# Altium schematic sheet POWER SWITCH AND LDO.SchDoc
size 420 x 297 mm; SheetNumber: 3; SheetTotal: 6
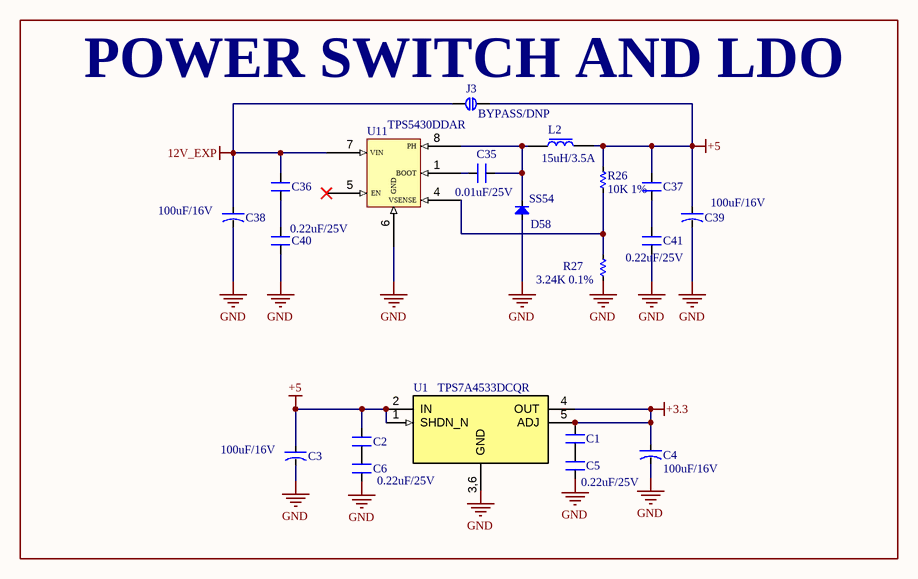
[diagram p0: POWER SWITCH AND LDO.SchDoc]

## Parts
C1  0.22uF/25V  [SM-0603]  (value not drawn)
C2  0.22uF/25V  [SM-0603]
C3  100uF/16V  [CAP TANT 2312]
C4  100uF/16V  [CAP TANT 2312]
C5  0.22uF/25V  [SM-0603]
C6  0.22uF/25V  [SM-0603]  (value not drawn)
C35  0.01uF/25V  [SM-0603]
C36  0.22uF/25V  [SM-0603]  (value not drawn)
C37  0.22uF/25V  [SM-0603]  (value not drawn)
C38  100uF/16V  [CAP TANT 2312]
C39  100uF/16V  [CAP TANT 2312]
C40  0.22uF/25V  [SM-0603]
C41  0.22uF/25V  [SM-0603]
D58  SS54  [DIO-SMD-A]
J3  BYPASS/DNP  [BIG_CONNECTOR]
L2  15uH/3.5A  [SRP7050TA]
R26  10K 1%  [RES-SMD-0603]
R27  3.24K 0.1%  [RES-SMD-0603]
U1  TPS7A4533DCQR  [SOT223-6]
U11  TPS5430DDAR  [HSOP8]

## Blocks framed on the sheet
POWER SWITCH AND LDO: C1-C6 C35-C41 D58 J3 L2 R26 R27 U1 U11

## Nets
12V_EXP: C36.2 C38.1 J3.1 U11.7(VIN)
+3.3: C1.2 C4.1 U1.4(OUT) U1.5(ADJ)
+5: C2.2 C3.1 C37.2 C39.1 J3.2 L2.2 R26.2 U1.1(SHDN_N) U1.2(IN)
GND: C3.2 C4.2 C5.1 C6.1 C38.2 C39.2 C40.1 C41.1 D58.1(A) R27.1 U1.3,6(GND) U11.6(GND)
NetC1_1: C1.1 C5.2
NetC2_1: C2.1 C6.2
NetC35_1: C35.1 D58.2(K) L2.1 U11.8(PH)
NetC35_2: C35.2 U11.1(BOOT)
NetC36_1: C36.1 C40.2
NetC37_1: C37.1 C41.2
NetR26_1: R26.1 R27.2 U11.4(VSENSE)

Not connected (* = marked no-connect by the designer): U11 5(EN)*

## Notes on the sheet
- Project:
- BEE-PC1
- Sub-system:
- Design by:
- Hung Nguyen D.
- Bao Bui Q.
- Sheet title:
- Sheet
- A3
- of
- Checked by:
- Approved by:
- Vu Pham
- Revision:
- Document No:
- V1.2.0
- Size:
- Date:

## Library data of the parts
C1 C2 C5 C6 C35-C37 C40 C41 = CM: 0603; Value: 103
C3 C4 C38 C39 = CN-ALU-SMD: Polarized Capacitor (Axial); Published: 8-Jun-2000; LatestRevisionDate: 17-Jul-2002; LatestRevisionNote: Re-released for DXP Platform.; PackageReference: POLAR0.8; Publisher: Altium Limited
D58 = Diode SMD: DIODE SCHOTTKY 40V 5A SMA; Code - JEDEC: DO-214-AB; Value: 1N5007; Published: 8-Jun-2000; Revision: July-2002: Re-released for DXP Platform.; Publisher: Altium Limited
J3 = CNT: DNP
L2 = INDUCTOR: SRP7050TA-150M
R26 = Res-SMD: 0603; Manufacturer: Generic Components; Class: Passive; Published: 08/06/2000; Publisher: Altium Hobart Technology Centre
R27 = Res-SMD: ERA-3AEB3241V; Manufacturer: Generic Components; Class: Passive; Published: 08/06/2000; Publisher: Altium Hobart Technology Centre
U1 = TPS7A4533DCQR: IC REG LINEAR 3.3V 1.5A SOT223-6
U11 = TPS543X: 8SOP; pin to pad: 6>6+9